# EAGLE design monotype_opto (EAGLE 6.4)
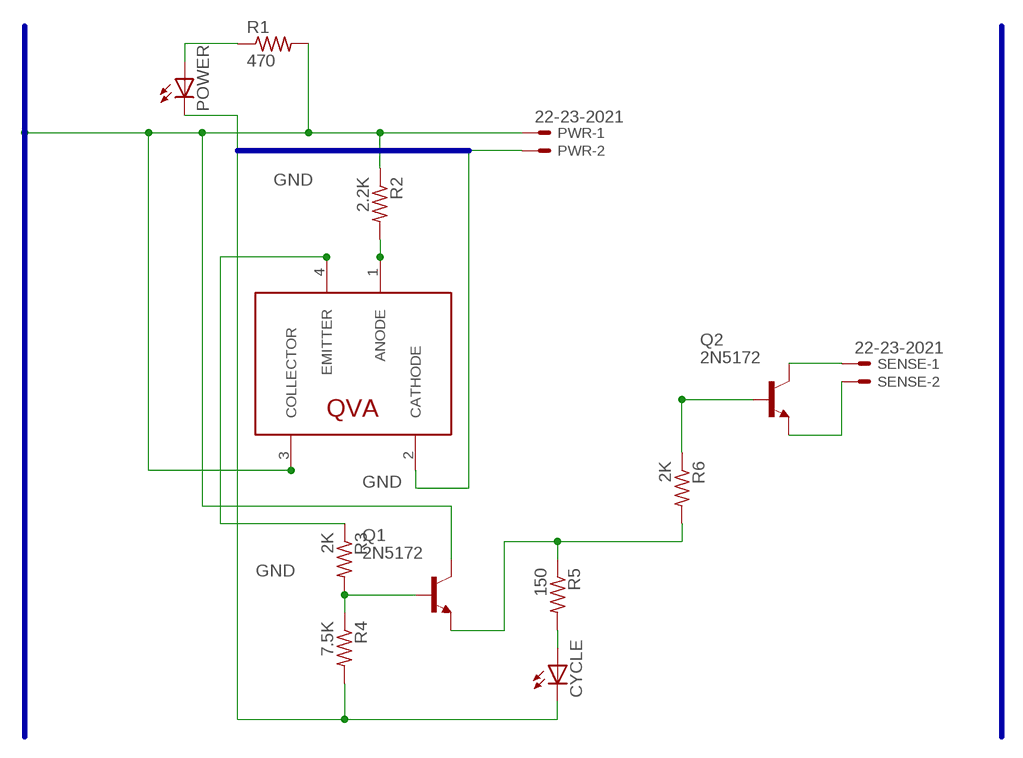
[diagram p0: schematic, sheet 1]

## Parts
CYCLE  LED3MM  [LED3MM]
POWER  LED3MM  [LED3MM]
PWR  22-23-2021  [22-23-2021]
Q1  2N5172  [TO92]
Q2  2N5172  [TO92]
R1  470  R-US_0411/12  [0411/12]
R2  2.2K  R-US_0411/12  [0411/12]
R3  2K  R-US_0411/12  [0411/12]
R4  7.5K  R-US_0411/12  [0411/12]
R5  150  R-US_0411/12  [0411/12]
R6  2K  R-US_0411/12  [0411/12]
SENSE  22-23-2021  [22-23-2021]
U$1  QVA  [QVA11134]

## Nets
+12V: PWR.1 Q1.2(C) R1.2 R2.1 U$1.3(COLLECTOR)
GND: CYCLE.K(C) POWER.K(C) PWR.2 R4.2 U$1.2(CATHODE)
N$1: Q2.1(B) R6.1
N$2: Q2.2(C) SENSE.1
N$3: Q1.3(E) R5.1 R6.2
N$4: POWER.A R1.1
N$5: Q2.3(E) SENSE.2
N$7: R2.2 U$1.1(ANODE)
N$8: CYCLE.A R5.2
N$10: Q1.1(B) R3.2 R4.1
N$11: R3.1 U$1.4(EMITTER)

## Buses
GND
+12V

## Library data of the parts
CYCLE POWER = SparkFun:LED: LEDs Standard schematic elements and footprints for 5mm, 3mm, 1206, and 0603 sized LEDs. 5mm - Spark Fun Electronics SKU : COM-00529 (and others)
PWR SENSE = con-molex:22-23-2021: .100" (2.54mm) Center Header - 2 Pin; MF: MOLEX; MPN: 22-23-2021; OC_FARNELL: 1462926; OC_NEWARK: 25C3832
Q1 Q2 = alchemy:2N5172: NPN Transistor
R1-R6 = resistor:R-US_: RESISTOR, American symbol
U$1 = alchemy:QVA: Fairchild QVA Series Slotted Optical Sensor

## Board
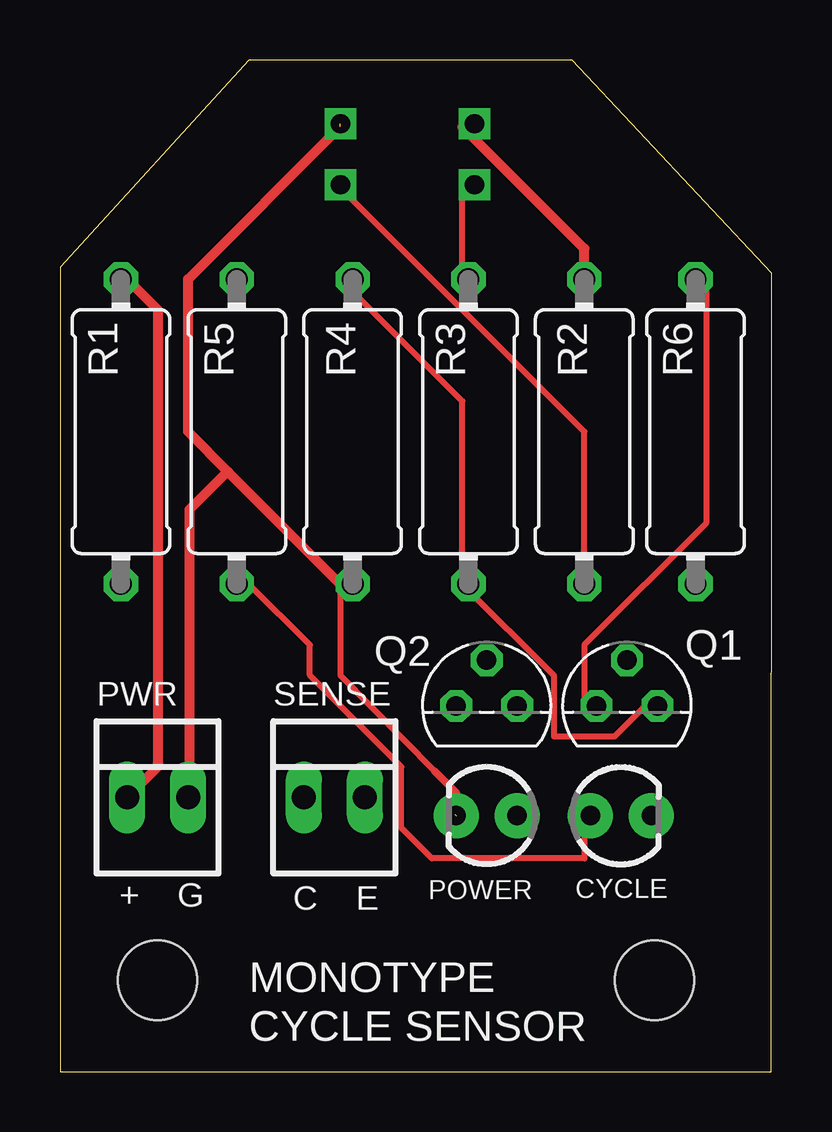
[diagram p1: board, top side]
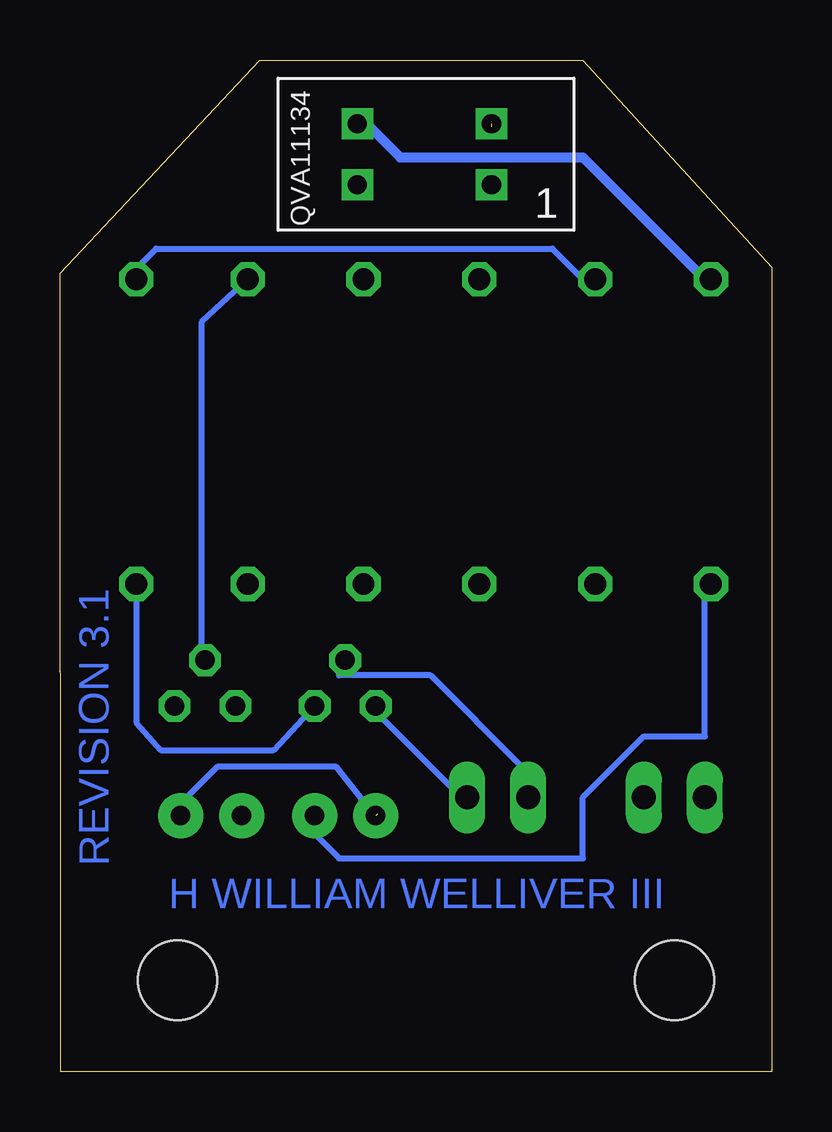
[diagram p2: board, bottom side, seen from below]

Size 29.66 x 42.15 mm. Coordinates in mm from the lower left corner, seen from the top.
Outline: 0,0 29.64,0 29.66,33.27 21.34,42.15 7.87,42.15 0,33.53 0,0
Copper layers (1*16): Top 0.035mm / dielectric 1.5mm / Bottom 0.035mm
Design rules "default": minimum track width 10mil, minimum drill 24mil, track to track 8mil, track to pad 8mil, pad to pad 8mil, via to via 8mil, smd to smd 8mil, copper to edge 40mil, drill to drill 8mil, minimum pad ring 10mil, minimum via ring 8mil, stop-mask expansion 4mil, vias tented up to drill 0mil, thermal gap 10mil

### Footprints (pad centres in the part's own frame; a part is rotated, then mirrored left to right if it is on the bottom)
LED3MM = drill 0.813 pad 1.88: A -1.27,0; K 1.27,0
22-23-2021 = drill 1 long: 1 -1.27,0; 2 1.27,0
TO92 = drill 0.813 octagon: 1 1.27,0; 2 0,1.905; 3 -1.27,0
0411/12 = drill 0.914 octagon: 1 -6.35,0; 2 6.35,0
QVA11134 = drill 0.8 square: 1 8.89,1.905; 2 8.89,4.445; 3 3.302,4.445; 4 3.302,1.905
STAND-OFF = hole 3.302: 0,0

### Placement (x,y rotation side)
CYCLE  23.37,10.67 0 top
POWER  17.78,10.67 180 top
PWR  4.06,11.43 0 top
Q1  23.62,15.24 0 top
Q2  17.78,15.24 0 top
R1  2.54,26.67 90 top
R2  21.84,26.67 270 top
R3  17.02,26.67 270 top
R4  12.19,26.67 270 top
R5  7.37,26.67 270 top
R6  26.48,26.67 90 top
SENSE  11.43,11.43 0 top
U$1  20.57,35.05 0 bottom
U$2  [STAND-OFF]  4.06,3.81 0 top
U$3  [STAND-OFF]  24.77,3.81 90 top

### Tracks (layer width: path | path; a pad name or v marks a point on that pad's centre or on a via)
+12V
  Top 0.254: 16.76,39.37 U$1.3 | 2.79,33.02 R1.2
  Top 0.406: 16.76,39.37 21.84,34.29 R2.1 | PWR.1 4.06,12.7 4.06,31.75 2.79,33.02
  Bottom 0.254: 2.79,33.02 R1.2 | 16.76,39.37 U$1.3 | 23.75,17.14 23.75,31.24 R2.1
  Bottom 0.406: 2.79,33.02 7.87,38.1 15.49,38.1 16.76,39.37 | Q1.2 23.75,17.14
GND  (2 unrouted)
  Top 0.254: 15.62,12.51 11.68,16.51 11.68,20.32 R4.2
  Top 0.305: 15.62,12.51 16.51,11.62 POWER.K
  Top 0.406: 11.68,39.37 5.33,33.02 5.33,26.67 7.02,24.99 | 7.02,24.99 11.68,20.32 | PWR.2 5.4,11.43 5.4,23.43 6.95,24.99 7.02,24.99
  Bottom 0.254: 16.76,11.43 16.45,10.54 18.16,12.7 23.11,12.7 24.38,11.43 CYCLE.K
  Bottom 0.305: 16.45,10.54 16.45,10.73
N$1
  Bottom 0.254: Q2.1 20.77,13.4 25.46,13.4 26.48,14.54 R6.1 26.92,20.32
N$2
  Bottom 0.254: Q2.2 18.03,16.51 14.22,16.51 10.41,12.7 10.41,11.43 SENSE.1
N$3
  Top 0.254: Q1.3 21.84,15.24 21.84,17.78 26.92,22.86 26.92,33.02 R6.2
  Bottom 0.254: R5.1 7.87,33.02 9.14,34.29 25.65,34.29 26.92,33.02 R6.2
N$4
  Bottom 0.254: R1.1 2.79,20.32 2.79,13.97 5.33,13.97 7.87,11.43 7.87,8.89 18.03,8.89 19.3,10.16 POWER.A
N$5
  Bottom 0.254: Q2.3 16.76,15.24 12.95,11.43 SENSE.2
N$7
  Top 0.254: R2.2 21.84,26.67 11.68,36.83 U$1.1
N$8
  Top 0.254: R5.2 7.87,20.32 10.41,17.78 10.41,16.51 14.22,12.7 14.22,10.16 15.49,8.89 21.84,8.89 21.84,10.16 CYCLE.A
N$10
  Top 0.254: 16.76,20.32 20.57,16.51 20.57,13.97 23.11,13.97 24.38,15.24 Q1.1 | 16.76,20.32 16.76,27.94 11.68,33.02 R4.1 | 16.76,20.32 R3.2
N$11
  Top 0.254: U$1.4 16.76,36.83 16.76,33.02 R3.1

### Text on the board
Bottom: REVISION 3.1 | H WILLIAM WELLIVER III
tNames: + G | C E | MONOTYPE | CYCLE SENSOR